# EAGLE design VBTSwakeupRadio (EAGLE 5.08)
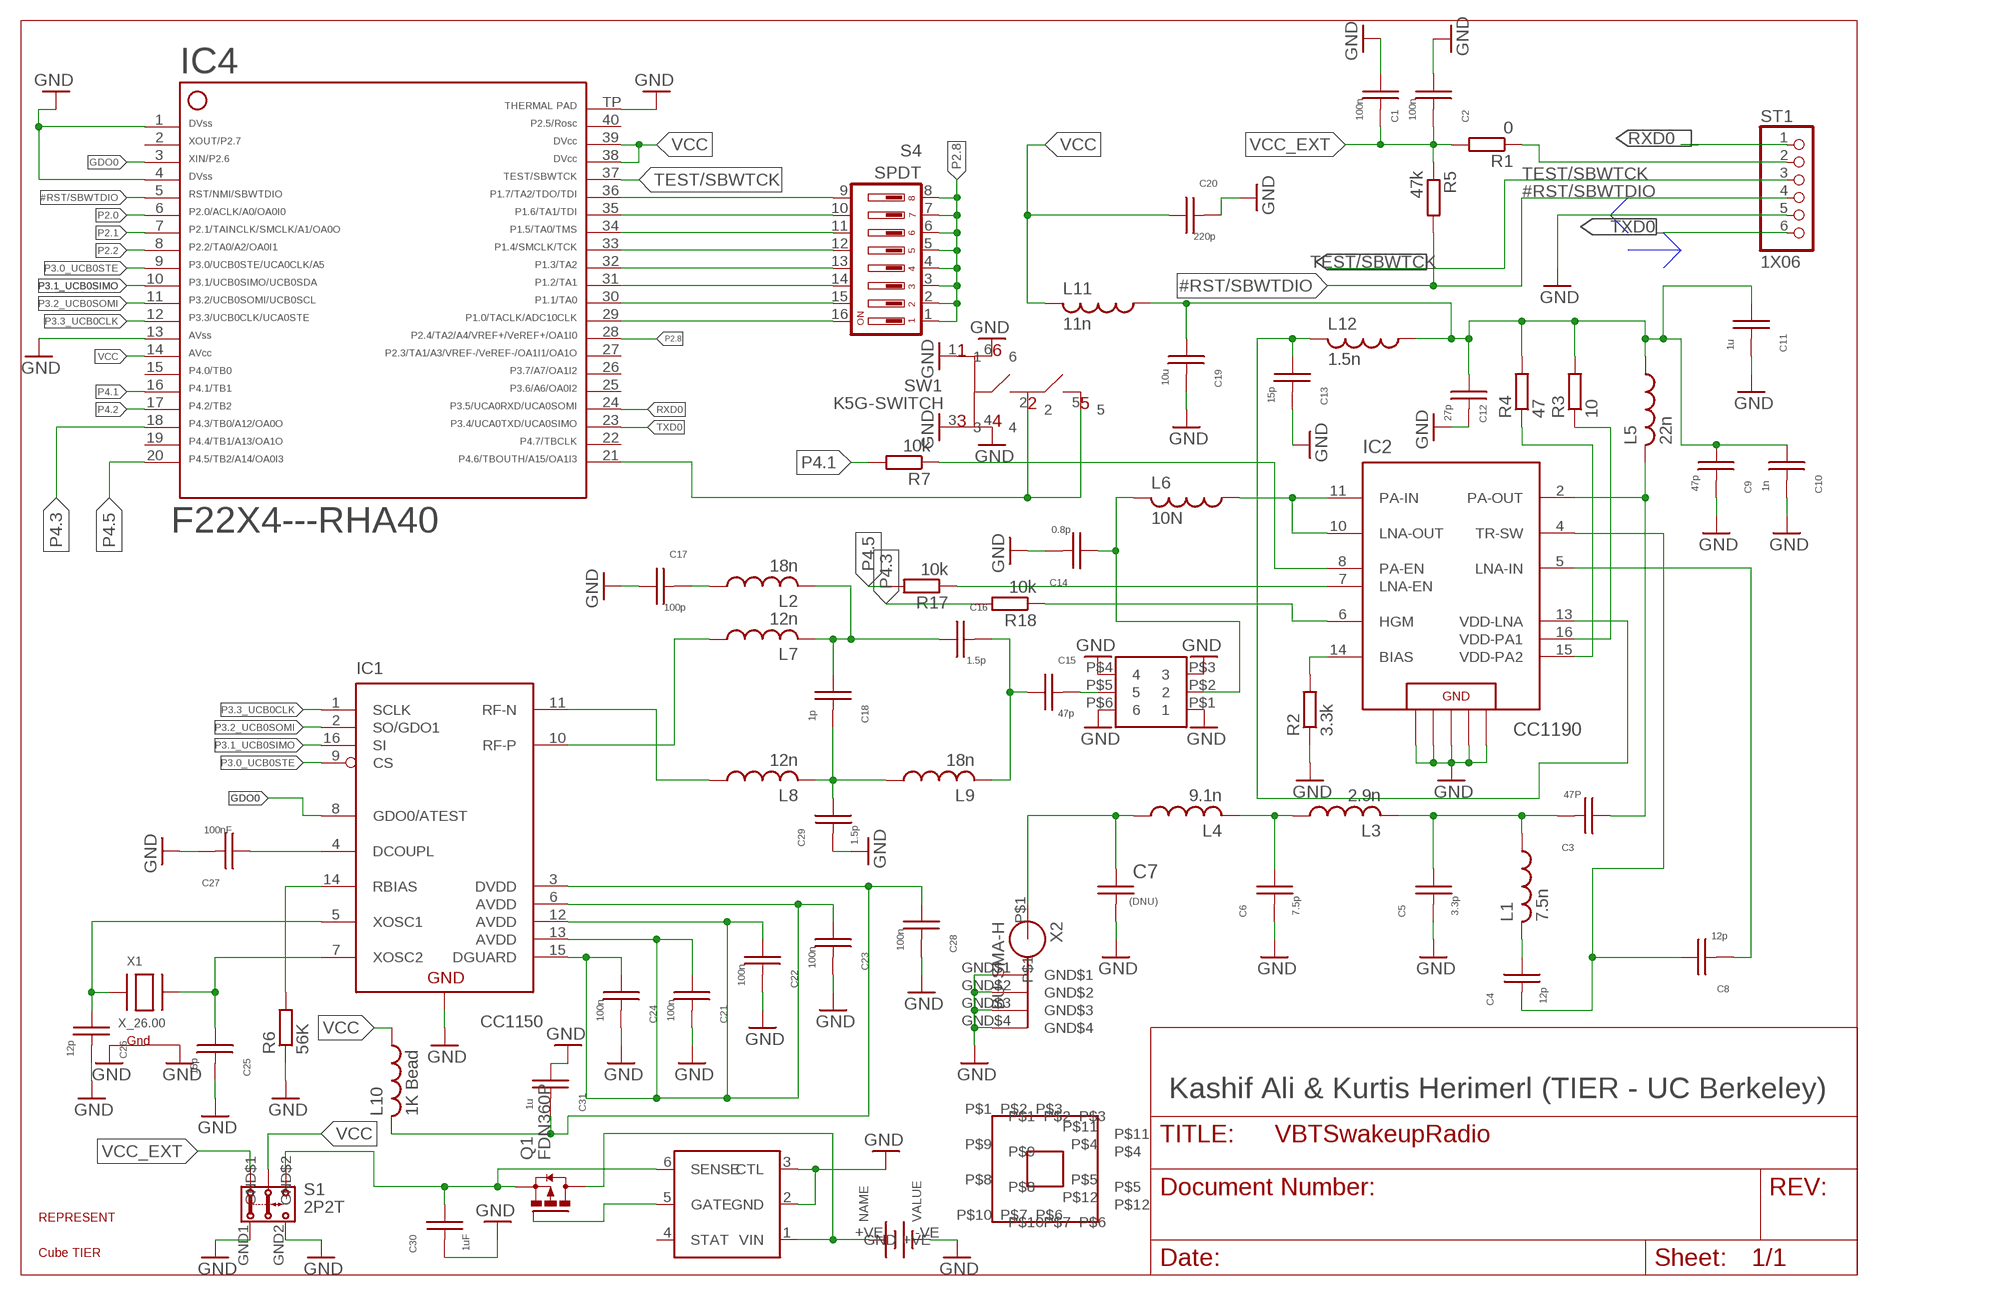
[diagram p0: schematic, sheet 1]

## Parts
C1  100n  C-USC0402  [C0402]
C2  100n  C-USC0402  [C0402]
C3  47P  C-USC0402  [C0402]
C4  12p  C-USC0402  [C0402]
C5  3.3p  C-USC0402  [C0402]
C6  7.5p  C-USC0402  [C0402]
C7  (DNU)  C-USC0402  [C0402]
C8  12p  C-USC0402  [C0402]
C9  47p  C-USC0402  [C0402]
C10  1n  C-USC0402  [C0402]
C11  1u  C-USC0402  [C0402]
C12  27p  C-USC0402  [C0402]
C13  15p  C-USC0402  [C0402]
C14  0.8p  C-USC0402  [C0402]
C15  47p  C-USC0402  [C0402]
C16  1.5p  C-USC0402  [C0402]
C17  100p  C-USC0402  [C0402]
C18  1p  C-USC0402  [C0402]
C19  10u  C-USC0402  [C0402]
C20  220p  C-USC0402  [C0402]
C21  100n  C-USC0402  [C0402]
C22  100n  C-USC0402  [C0402]
C23  100n  C-USC0402  [C0402]
C24  100n  C-USC0402  [C0402]
C25  15p  C-USC0402  [C0402]
C26  12p  C-USC0402  [C0402]
C27  100nF  C-USC0402  [C0402]
C28  100n  C-USC0402  [C0402]
C29  1.5p  C-USC0402  [C0402]
C30  1uF  C-USC0805  [C0805]
C31  1u  C-USC0402  [C0402]
IC1  CC1150  [QFN65P400X400X95-17N]
IC2  CC1190  [QFN65P400X400X100-17N]
IC3  B3588  [B3588]
IC4  F22X4---RHA40  [RHA40]
L1  7.5n  L-USL2012C  [L2012C]
L2  18n  L-USL2012C  [L2012C]
L3  2.9n  L-USL2012C  [L2012C]
L4  9.1n  L-USL2012C  [L2012C]
L5  22n  L-USL2012C  [L2012C]
L6  10N  L-USL2012C  [L2012C]
L7  12n  L-USL2012C  [L2012C]
L8  12n  L-USL2012C  [L2012C]
L9  18n  L-USL2012C  [L2012C]
L10  1K Bead  L-USL2012C  [L2012C]
L11  11n  L-USL2012C  [L2012C]
L12  1.5n  L-USL2012C  [L2012C]
Q1  FDN360P  [SUPER-SOT3]
R1  0  R-EU_R0402_GE  [C0402_GE]
R2  3.3k  R-EU_R0402  [R0402]
R3  10  R-EU_R0402  [R0402]
R4  47  R-EU_R0402  [R0402]
R5  47k  R-EU_R0402_GE  [C0402_GE]
R6  56K  R-EU_R0402  [R0402]
R7  10k  R-EU_R0402  [R0402]
R17  10k  R-EU_R0402  [R0402]
R18  10k  R-EU_R0402  [R0402]
S1  2P2T  [2P2T]
S3  BMI-S-202  [BMI-S-202-F]
S4  SPDT  DIP08YL  [DIP08YL]
ST1  1X06  [1X06]
SW1  K5G-SWITCH  [K5G-SWITCH]
U1  LTC4412  [LTC4412]
U$1  BATTERY-HOLDER  [BATTER-HOLDER]
U$2  CUBETIERABV  [SMALLABV]
U$3  REPRESENT-50  [REPRESENT-50]
X1  X_26.00  XTAL-4-3225  [NX3225]
X2  BU-SMA-H  [BU-SMA-H]

## Nets
#RST/SBWTDIO: IC4.5 R5.P$2 ST1.4
GDO0: IC1.8(GDO0/ATEST) IC4.3
GND [Ground]: C1.1 C2.1 C5.2 C6.2 C7.2 C9.2 C10.2 C11.2 C12.2 C13.2 C14.2 C17.1 C19.2 C20.2 C21.2 C22.2 C23.2 C24.2 C25.2 C26.2 C27.2 C28.2 C29.2 C30.2 C31.1 IC1.17(GND) IC2.1(GND) IC2.3(GND) IC2.9(GND) IC2.12(GND) IC2.17(GND-PL) IC3.P$1 IC3.P$3 IC3.P$4 IC3.P$6 IC4.1 IC4.4 IC4.13 IC4.TP R2.1 R6.1 S1.GND1(GND$1) S1.GND2(GND$2) ST1.5 SW1.1 SW1.3 SW1.4 SW1.6 U1.2(GND) U1.3(CTL) U$1.-VE(GND) X1.2(G2) X1.4(G1) X2.GND$1 X2.GND$2 X2.GND$3 X2.GND$4
N$1: IC2.8(PA-EN) R7.1
N$2: C3.2 C5.1 L1.1 L3.2
N$3: C6.1 L3.1 L4.2
N$4: C4.1 L1.2
N$5: C7.1 L4.1 X2.P$1
N$6: C8.2 IC2.5(LNA-IN)
N$7: C14.1 IC3.P$2 L6.2
N$8: C15.2 IC3.P$5
N$9: IC2.14(BIAS) R2.2
N$10: IC2.16(VDD-PA1) R3.1
N$11: IC2.15(VDD-PA2) R4.1
N$12: C13.1 IC2.13(VDD-LNA) L12.2
N$13: IC2.10(LNA-OUT) IC2.11(PA-IN) L6.1
N$14: C15.1 C16.2 L9.2
N$15: C18.2 C29.1 L8.2 L9.1
N$16: C16.1 C18.1 L2.2 L7.2
N$17: IC1.11(RF-N) L8.1
N$18: IC1.10(RF-P) L7.1
N$19: IC2.6(HGM) R18.1
N$20: C28.1 C31.2 IC1.3(DVDD) L10.2
N$21: C17.2 L2.1
N$22: IC4.31 S4.14
N$23: IC4.21 SW1.2 SW1.5
N$24: IC1.14(RBIAS) R6.2
N$27: C3.1 IC2.2(PA-OUT) L5.2
N$28: C26.1 IC1.5(XOSC1) X1.1(X1)
N$29: C25.1 IC1.7(XOSC2) X1.3(X2)
N$30: C27.1 IC1.4(DCOUPL)
N$34: IC2.7(LNA-EN) R17.1
N$35: C4.2 C8.1 IC2.4(TR-SW)
N$36: Q1.1(G) U1.5(GATE)
N$37: IC4.32 S4.13
N$38: IC4.29 S4.16
N$39: Q1.3(D) U1.1(VIN) U$1.+VE
N$40: C30.1 Q1.2(S) S1.3.1 U1.6(SENSE)
N$41: C9.1 C10.1 C11.1 C12.1 C19.1 L5.1 L11.1 L12.1 R3.2 R4.2
N$42: IC4.33 S4.12
N$43: IC4.34 S4.11
N$44: IC4.35 S4.10
N$45: IC4.36 S4.9
P2.0: IC4.6
P2.1: IC4.7
P2.2: IC4.8
P2.8: IC4.28 S4.1 S4.2 S4.3 S4.4 S4.5 S4.6 S4.7 S4.8
P3.0_UCB0STE: IC1.9(CS) IC4.9
P3.1_UCB0SIMO: IC1.16(SI) IC4.10
P3.2_UCB0SOMI: IC1.2(SO/GDO1) IC4.11
P3.3_UCB0CLK: IC1.1(SCLK) IC4.12
P4.1: IC4.16 R7.2
P4.2: IC4.17
P4.3: IC4.18 R18.2
P4.4: IC4.30 S4.15
P4.5: IC4.20 R17.2
RXD0: IC4.24 ST1.1
TEST/SBWTCK: IC4.37 ST1.3
TXD0: IC4.23 ST1.6
V: R1.P$1 ST1.2
VCC: C20.1 C21.1 C22.1 C23.1 C24.1 IC1.6(AVDD) IC1.12(AVDD) IC1.13(AVDD) IC1.15(DGUARD) IC4.14 IC4.38 IC4.39 L10.1 L11.2 S1.2.1
VCC_EXT: C1.2 C2.2 R1.P$2 R5.P$1 S1.1.1
Unconnected: IC4.2 IC4.15 IC4.19 IC4.22 IC4.25 IC4.26 IC4.27 IC4.40 S3.P$1 S3.P$2 S3.P$3 S3.P$4 S3.P$5 S3.P$6 S3.P$7 S3.P$8 S3.P$9 S3.P$10 S3.P$11 S3.P$12 U1.4(STAT)

## Notes on the sheet
- Kashif Ali & Kurtis Herimerl (TIER - UC Berkeley)

## Library data of the parts
C1-C31 = vbts:C-US: CAPACITOR, American symbol
IC1 = chipcon-ti-v2:CC1150: Single Chip Low Cost Low Power RF-Transmitter
IC2 = chipcon-ti-v2:CC1190: 850 - 950 MHz RF Front End
IC3 = vbts:B3588: SAW
IC4 = vbts:F22X4---RHA40: ***MSP430F22x4***RHA40
L1-L12 = vbts:L-US: INDUCTOR, American symbol
Q1 = transistor-power:FDN360P: Single P-Channel, PowerTrench (R) MOSFET Source: http://www.fairchildsemi.com/ds/FD/FDN360P.pdf
R1 R5 = rcl:R-EU_: RESISTOR, European symbol
R2-R4 R6 R7 R17 R18 = vbts:R-EU_: RESISTOR, European symbol
S1 = vbts:2P2T: SLIDE SWITCH SPDT Part No. JS102000SAQN Source: http://search.digikey.com/scripts/DkSearch/dksus.dll?Detail&itemSeq=112587719&uq=634684747549229980
S3 = vbts:BMI-S-202
S4 = vbts:DIP08YL: DIL/CODE SWITCH I-1825058-9 http://search.digikey.com/scripts/DkSearch/dksus.dll?Detail&itemSeq=112401346&uq=634685631903277898
ST1 = pinhead_1.27mm:1X06
SW1 = vbts:K5G-SWITCH
U1 = vbts:LTC4412
U$1 = vbts:BATTERY-HOLDER
U$2 = TIERLogo-1:CUBETIERABV
U$3 = TIERLogo-1:REPRESENT-50
X1 = vbts:XTAL-4: CRYSTAL 26.000 MHZ 10PF SMD http://search.digikey.com/scripts/DkSearch/dksus.dll?Detail&itemSeq=112341585&uq=634679703811047285
X2 = vbts:BU-SMA-H: FEMALE SMA CONNECTOR Radiall

## Net classes
0 default: width 0.1 mm, drill 0.2 mm
1 Ground: width 0.1 mm, drill 0.2 mm

## Board
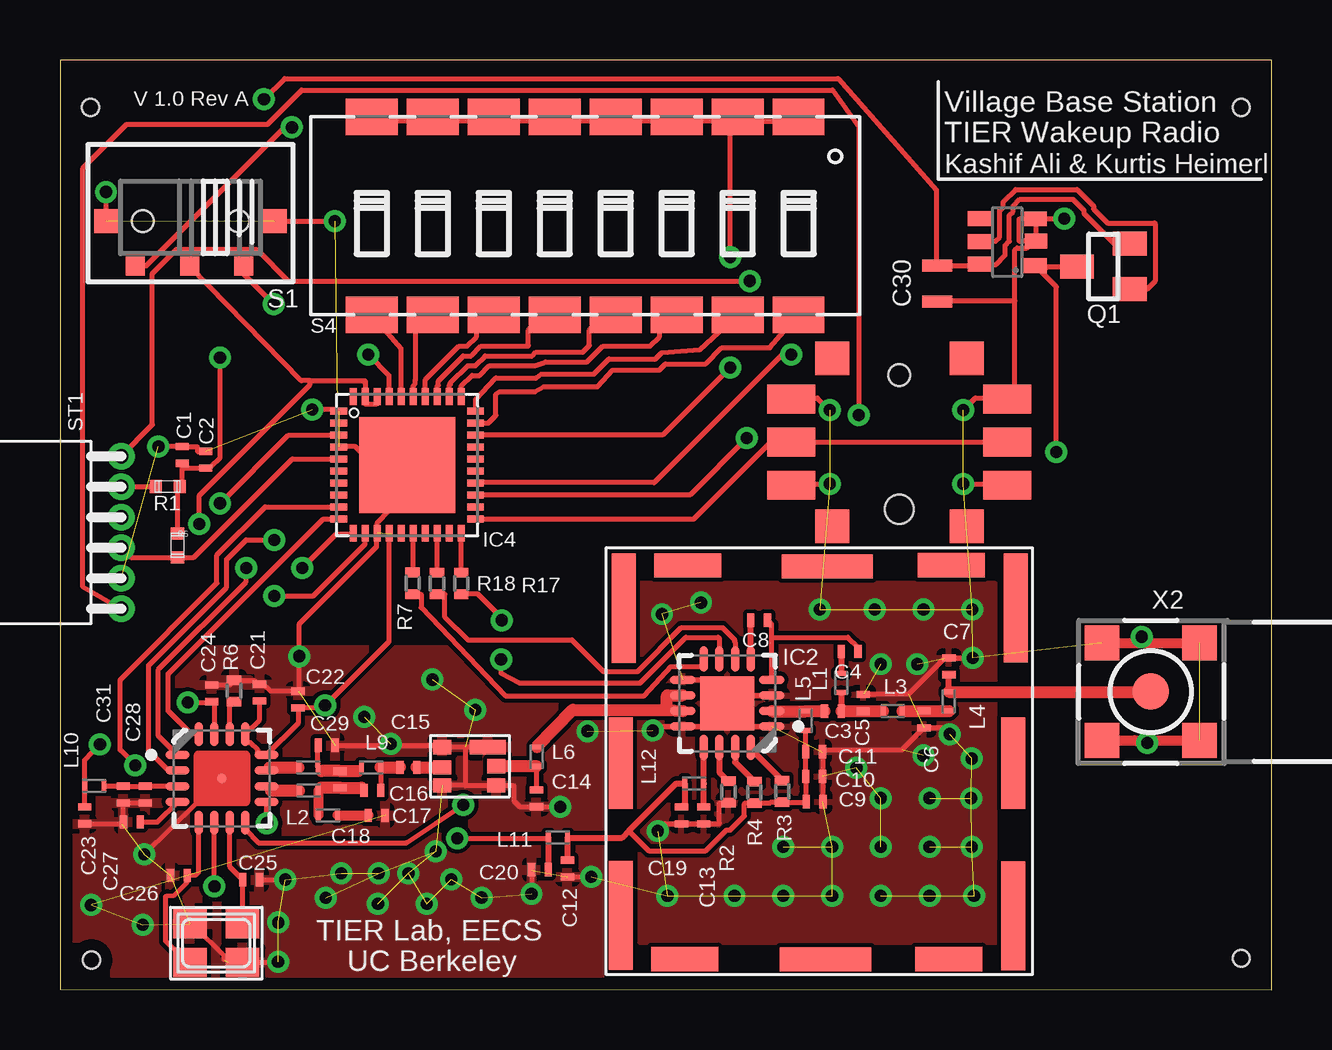
[diagram p1: board, top side]
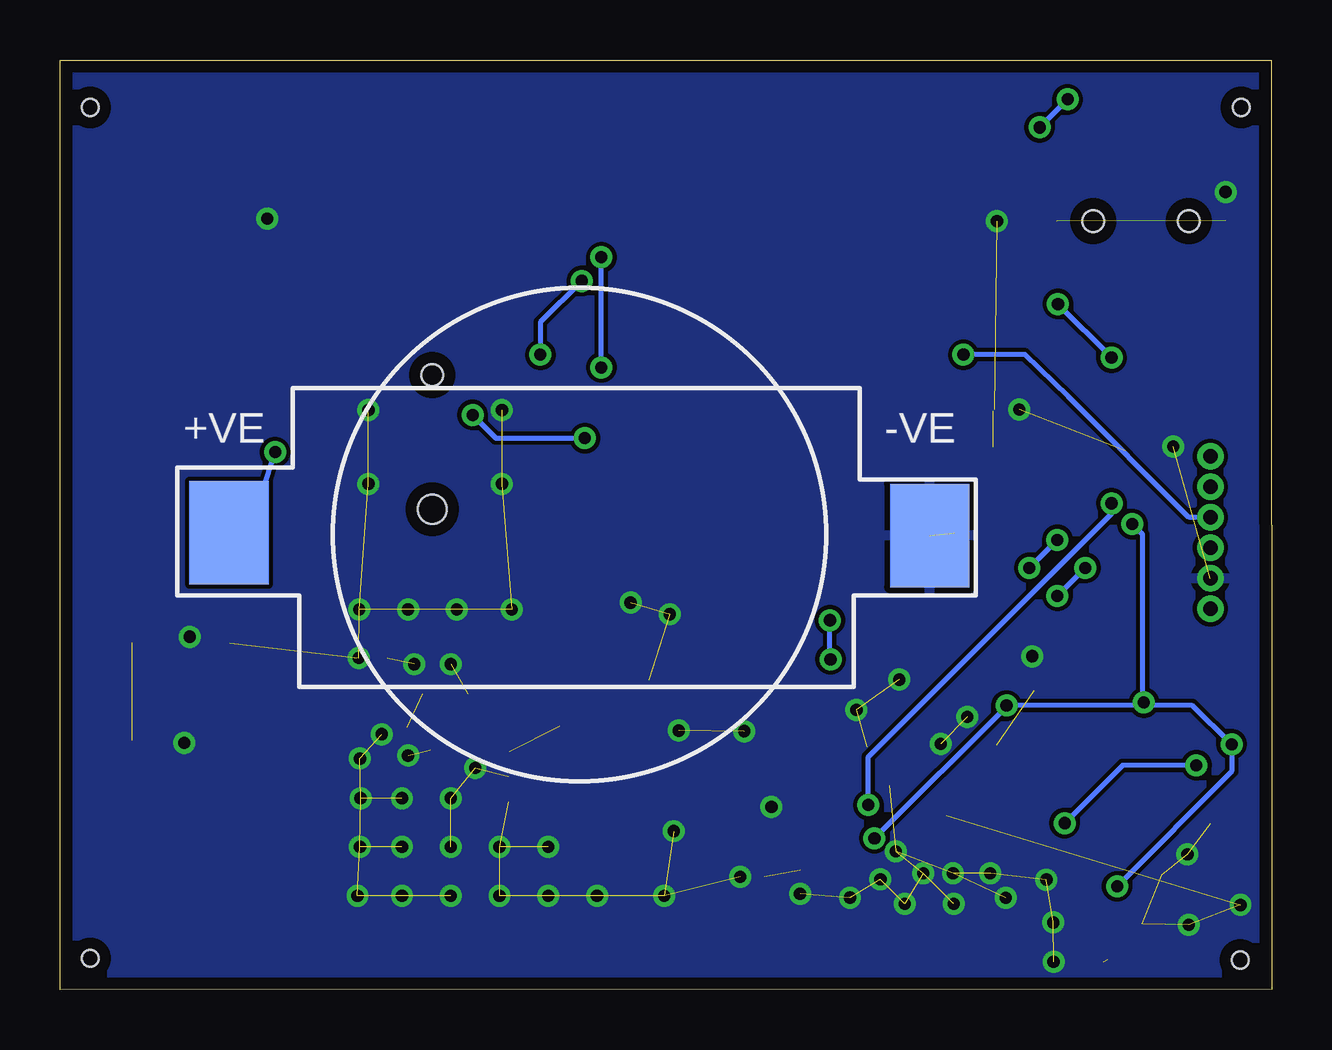
[diagram p2: board, bottom side, seen from below]

Size 50.48 x 38.75 mm. Coordinates in mm from the lower left corner, seen from the top.
Outline: 0,0.01 50.48,0 50.48,38.75 0.01,38.75 0,0.01
Copper layers (1*16): Top 0.0356mm / dielectric 1.5011mm / Bottom 0.0356mm
Design rules "SilverCircuits": minimum track width 7mil, minimum drill 14mil, track to track 7mil, track to pad 7mil, pad to pad 7mil, via to via 7mil, smd to smd 0mil, copper to edge 20mil, drill to drill 8mil, minimum pad ring 10mil, minimum via ring 8mil, stop-mask expansion 4mil, vias tented up to drill 0mil, thermal gap 10mil
Holes 0.7 mm at 1.31,1.23 49.22,1.3 49.22,36.77 1.27,36.77

### Footprints (pad centres in the part's own frame; a part is rotated, then mirrored left to right if it is on the bottom)
C0402 = smd 0.3 x 0.55: 1 -0.35,0; 2 0.35,0
C0805 = smd 0.5 x 1.25: 1 -0.75,0; 2 0.75,0
QFN65P400X400X95-17N = smd 1 x 0.35: 1 -1.85,0.975; 2 -1.85,0.325; 3 -1.85,-0.325; 4 -1.85,-0.975; 9 1.85,-0.975; 10 1.85,-0.325; 11 1.85,0.325; 12 1.85,0.975 | smd 0.35 x 1: 5 -0.975,-1.85; 6 -0.325,-1.85; 7 0.325,-1.85; 8 0.975,-1.85; 13 0.975,1.85; 14 0.325,1.85; 15 -0.325,1.85; 16 -0.975,1.85 | smd 0.4 x 0.4: 17 0,0
QFN65P400X400X100-17N = smd 1.05 x 0.35: 1 -1.85,0.975; 2 -1.85,0.325; 3 -1.85,-0.325; 4 -1.85,-0.975; 9 1.85,-0.975; 10 1.85,-0.325; 11 1.85,0.325; 12 1.85,0.975 | smd 0.35 x 1.05: 5 -0.975,-1.85; 6 -0.325,-1.85; 7 0.325,-1.85; 8 0.975,-1.85; 13 0.975,1.85; 14 0.325,1.85; 15 -0.325,1.85; 16 -0.975,1.85 | smd 2.25 x 2.25: 17 0,0
B3588 = smd 0.6 x 1.5: P$1 -0.8,0.75 | smd 0.6 x 0.75: P$2 0,1.1; P$3 0.8,1.1; P$4 0.8,-1.15; P$5 0.05,-1.15; P$6 -0.8,-1.15
RHA40 = smd 0.7 x 0.3: 1 -2.85,2.25; 2 -2.85,1.75; 3 -2.85,1.25; 4 -2.85,0.75; 5 -2.85,0.25; 6 -2.85,-0.25; 7 -2.85,-0.75; 8 -2.85,-1.25; 9 -2.85,-1.75; 10 -2.85,-2.25; 21 2.85,-2.25; 22 2.85,-1.75; 23 2.85,-1.25; 24 2.85,-0.75; 25 2.85,-0.25; 26 2.85,0.25; 27 2.85,0.75; 28 2.85,1.25; 29 2.85,1.75; 30 2.85,2.25 | smd 0.3 x 0.7: 11 -2.25,-2.85; 12 -1.75,-2.85; 13 -1.25,-2.85; 14 -0.75,-2.85; 15 -0.25,-2.85; 16 0.25,-2.85; 17 0.75,-2.85; 18 1.25,-2.85; 19 1.75,-2.85; 20 2.25,-2.85; 31 2.25,2.85; 32 1.75,2.85; 33 1.25,2.85; 34 0.75,2.85; 35 0.25,2.85; 36 -0.25,2.85; 37 -0.75,2.85; 38 -1.25,2.85; 39 -1.75,2.85; 40 -2.25,2.85 | smd 4 x 4: TP 0,0
L2012C = smd 0.2 x 0.5: 1 -0.4,0; 2 0.4,0
SUPER-SOT3 = smd 1 x 1.4: 1 -0.95,-1.1; 2 0.95,-1.1; 3 0,1.1
C0402_GE = smd 0.5 x 0.55: P$1 -0.5,0; P$2 0.5,0
R0402 = smd 0.4 x 0.6: 1 -0.45,0; 2 0.45,0
2P2T = smd 0.787 x 0.787: 1.1 -2.845,2.794; 2.1 -0.584,2.794; 3.1 1.676,2.794 | smd 0.991 x 0.991: GND1 -4.14,0.914; GND2 2.896,0.914 | hole 0.9: 1.372,0.914; -2.616,0.914
BMI-S-202-F = smd 2.794 x 1.016: P$1 3.164,0; P$8 3.279,16.405; P$9 14.271,16.425; P$10 14.161,0 | smd 3.8 x 1: P$2 9.025,0; P$6 9.1,16.37 | smd 1 x 4.55: P$3 0.5,1.825; P$5 0.61,14.63; P$7 16.95,14.64; P$11 16.85,1.8 | smd 1 x 3.8: P$4 0.5,8.17; P$12 16.85,8.17
DIP08YL = smd 2.159 x 1.524: 1 -8.89,-4.445; 2 -6.35,-4.445; 3 -3.81,-4.445; 4 -1.27,-4.445; 5 1.27,-4.445; 6 3.81,-4.445; 7 6.35,-4.445; 8 8.89,-4.445; 9 8.89,3.81; 10 6.35,3.81; 11 3.81,3.81; 12 1.27,3.81; 13 -1.27,3.81; 14 -3.81,3.81; 15 -6.35,3.81; 16 -8.89,3.81
1X06 = drill 0.6 round: 1 -3.175,0; 2 -1.905,0; 3 -0.635,0; 4 0.635,0; 5 1.905,0; 6 3.175,0
K5G-SWITCH = smd 1.2 x 2: 1 -2.55,1.65; 2 -0.75,1.65; 3 1.05,1.65; 4 1.05,-7.35; 5 -0.75,-7.35; 6 -2.55,-7.35 | smd 1.4 x 1.42: P$7 -4.25,-0.05; P$8 2.75,-0.05; P$9 -4.25,-5.65; P$10 2.75,-5.65 | hole 0.9: 2.05,-2.85 | hole 1.2: -3.55,-2.85
LTC4412 = smd 0.62 x 0.95: 1 -1.01,-0.94; 2 0.01,-0.97; 3 0.94,-0.95; 4 0.95,1.4; 5 0,1.4; 6 -0.95,1.4
BATTER-HOLDER = smd 3.302 x 4.318: +VE -14.6,0.073; -VE 14.6,-0.046
NX3225 = smd 1.4 x 1.2: 1 -1.1,-0.8; 2 1.1,-0.8; 3 1.1,0.8; 4 -1.1,0.8
BU-SMA-H = smd 1.448 x 1.448: GND$1 2.032,2.032; GND$2 -2.032,2.032; GND$3 -2.032,-2.032; GND$4 2.032,-2.032 | smd 1.524 x 1.524: P$1 0,0

### Placement (x,y rotation side)
C1  5.09,22.29 270 top
C2  6.07,22.09 270 top
C3  32.2,11.61 0 top
C4  32.9,14.09 0 top
C5  33.46,11.96 90 top
C6  36,11.26 270 top
C7  37.04,13.48 90 top
C8  29.13,15.39 180 top
C9  31.44,7.83 0 top
C10  31.42,8.89 0 top
C11  31.42,9.91 0 top
C12  21.15,5.05 270 top
C13  26.83,7.26 270 top
C14  19.85,7.98 270 top
C15  14.51,9.26 0 top
C16  13.01,8.3 0 top
C17  13.2,7.26 180 top
C18  11.67,8.76 90 top
C19  25.9,7.26 270 top
C20  20,5 180 top
C21  8.32,12.38 90 top
C22  9.92,12.09 90 top
C23  1.03,7.27 270 top
C24  6.32,12.35 90 top
C25  7.96,4.58 0 top
C26  4.95,4.76 180 top
C27  2.99,7 180 top
C28  3.55,8.13 270 top
C29  11.11,10.19 0 top
C30  36.56,29.44 270 top
C31  2.64,8.13 90 top
IC1  6.75,8.8 0 top
IC2  27.8,11.94 180 top
IC3  17.08,9.31 270 top
IC4  14.47,21.87 0 top
L1  32.55,12.78 90 top
L2  11.16,7.26 180 top
L3  34.7,11.61 180 top
L4  37.04,12.01 270 top
L5  31.07,11.2 90 top
L6  19.87,9.71 270 top
L7  10.36,8.3 0 top
L8  10.35,9.26 0 top
L9  12.96,9.26 0 top
L10  1.43,8.48 0 top
L11  20.74,6.33 180 top
L12  26.43,8.59 0 top
Q1  43.47,30.14 90 top
R1  4.49,20.97 0 top
R2  27.85,8.23 90 top
R3  30.09,8.26 270 top
R4  28.93,8.22 270 top
R5  4.9,18.52 270 top
R6  7.25,12.45 270 top
R7  14.69,16.94 90 top
R17  16.72,16.93 90 top
R18  15.71,16.93 90 top
S1  4.82,32.95 180 top
S3  22.87,1.27 0 top
S4  21.88,31.94 180 top
ST1  2.55,19.05 270 top
SW1  32.12,23.57 90 top
U1  39.7,31.18 90 top
U$1  28.84,18.97 0 bottom
U$2  46.74,22.97 270 top
U$3  43.88,6.23 270 top
X1  6.51,1.94 0 top
X2  45.45,12.42 0 top

### Tracks (layer width: path | path; a pad name or v marks a point on that pad's centre or on a via)
#RST/SBWTDIO
  Top 0.203: ST1.4 | IC4.5 9.69,22.12 5.58,18.02 R5.P$2 2.95,18.02 ST1.4
  Bottom 0.203: ST1.4 2.51,18.41 2.51,18.43
GDO0  (via drill 0.51)
  Top 0.203: v6.67,20.27 9.51,23.11 11.59,23.11 IC4.3 | v16.8,7.7 14.44,6.12 8.27,6.12 7.73,6.66 7.73,6.93 IC1.8
  Bottom 0.203: v6.67,20.27 6.67,19.84 16.8,9.7 v16.8,7.7
GND  (via drill 0.51)  (68 unrouted)
  Top 0.178: v3.51,5.63 IC1.17 | X1.4 5.6,2.64 6.82,1.42 6.82,1.23
  Top 0.203: v38.04,13.82 37.05,13.82 C7.2 36.94,13.79 36.84,13.79 35.37,12.32 33.49,12.32 C5.2 | IC2.17 27.11,11.94 27.09,11.91 27.09,11.35 26.71,10.97 25.97,10.97 IC2.12 25.87,10.97 24.88,10.97 v24.7,10.79 | IC2.9 25.97,12.9 26.71,12.9 27.06,12.55 27.06,12.01 IC2.17 | IC2.1 29.63,10.97 28.89,10.97 28.54,11.33 28.54,11.91 28.51,11.94 27.9,11.94 IC2.17 | IC2.3 29.63,12.27 28.87,12.27 28.59,11.99 IC2.17 | 16.88,8.51 IC3.P$4 | 16.88,8.51 18.1,8.51 IC3.P$3 18.2,8.51 18.88,8.51 18.91,8.48 18.91,7.87 19.16,7.62 C14.2 19.95,7.62 v20.84,7.62 | 16.88,10.11 IC3.P$6 15.86,10.19 13.78,10.19 | 16.88,10.11 17.82,10.11 IC3.P$1 | R2.1 27.47,7.77 27.47,6.93 27.44,6.91 26.91,6.91 C13.2 26.81,6.91 C19.2 25.82,6.91 25.21,6.91 v24.9,6.6 | v19.65,3.99 19.65,4.98 C20.2 | C12.2 v22.14,4.7 | C12.2 | v37.07,10.64 36.84,10.92 36,10.92 C6.2 35.93,10.85 35.06,9.98 31.86,9.98 C11.2 31.79,9.91 31.79,8.89 C10.2 31.79,8.81 31.79,7.85 C9.2 | 11.59,22.63 IC4.4 11.7,22.63 12.31,22.63 13.04,21.89 13.65,21.89 IC4.TP 13.75,21.87 13.73,21.84 13.73,19.96 13.22,19.46 IC4.13 13.2,18.92 13.2,18.47 9.97,15.24 v9.97,13.89 9.97,12.52 C22.2 9.89,12.45 8.78,12.45 8.5,12.72 C21.2 8.22,12.75 8.09,12.88 7.35,12.88 R6.1 7.25,12.88 7.07,12.7 6.34,12.7 C24.2 | 11.59,24.13 IC4.1 11.55,24.18 v10.52,24.18 | v32.07,21.08 30.37,21.08 SW1.1 | v32.07,24.16 31.56,24.66 30.37,24.66 SW1.3 | v37.63,21.08 39.33,21.08 SW1.6 | v37.63,24.16 38.14,24.66 39.33,24.66 SW1.4 39.43,24.66 39.79,24.66 39.79,28.7 | U1.2 40.65,31.22 40.65,32.11 U1.3 | C2.1 6.06,22.43 5.73,22.43 5.73,22.61 5.7,22.63 C1.1 5.02,22.63 v4.1,22.63 | v41.85,32.13 40.73,32.13 U1.3
  Top 0.203: 39.79,28.7 39.79,30.84 39.87,30.91 40.27,30.91 40.53,31.17 40.53,31.19 39.99,31.19 39.97,31.22 39.97,32.11 39.99,32.13 40.55,32.13 U1.3 | v1.92,33.25 1.92,32.05 S1.GND2 | v11.44,32.03 8.98,32.03 S1.GND1 | C30.2 36.56,28.7 39.79,28.7 | C28.2 C31.1 C27.2 2.57,6.92 C23.2 | C25.2 v9.38,4.58 | v9.09,1.16 9.07,1.14 X1.2 7.01,1.14 | 16.88,10.11 16.88,8.51 | 13.78,10.19 C29.2 | 13.78,10.19 v13.78,10.24
  Top 0.406: X2.GND$3 44.77,10.39 | 44.77,10.39 X2.GND$4 | 44.77,10.39 v45.3,10.29 | 44.84,14.45 X2.GND$1 | X2.GND$2 44.84,14.45 | 44.84,14.45 v45.07,14.71
  other vias: 11.07,3.82 21.98,10.77 17.3,11.65 15.66,5.76 12.68,11.36 9.1,2.79 3.45,2.7 37.99,9.63 37.96,7.98 33.19,9.25 38.09,3.91 37.99,5.94 35.73,13.56 34.2,13.56 38.01,15.85 35.98,9.75 36.23,7.98 36.23,5.94 36.23,3.91 34.2,7.98 34.2,5.94 34.2,3.91 32.17,3.91 32.17,5.94 30.14,5.94 30.14,3.91 28.11,3.91 35.98,15.85 33.95,15.85 31.66,15.85 25.31,3.91 13.27,4.85 14.52,4.85 11.72,4.85 15.28,3.58 13.25,3.58 15.52,12.92 1.3,3.52 16.3,4.59 17.57,3.83 25.08,15.65 26.71,16.13
  pour Bottom: 0.01,37.85 -0.2,-0.43 50.56,0 50.56,38.58 0.27,38.58 0.27,37.59
  pour Top: 24.16,1.96 38.98,1.96 38.98,16.93 24.12,16.93
  pour Top: 0.75,14.15 22.39,14.15 22.39,12.95 22.47,12.95 22.47,0.51 0.7,0.51 0.7,14.1 0.9,14.1
N$1
  Top 0.203: R7.1 15.02,16.48 15.05,16.46 15.05,15.93 18.55,12.24 24.35,12.24 25.46,13.46 26.83,13.46 26.83,13.77 IC2.8
N$2
  Top 0.254: C5.1 | C3.2 L1.1 | L3.2
  Top 0.508: C3.2 C5.1 | C5.1 L3.2
N$3
  Top 0.254: C6.1 | L4.2
  Top 0.508: L3.1 C6.1 | C6.1 L4.2
N$4
  Top 0.254: L1.2 C4.1
N$5
  Top 0.254: L4.1 C7.1
  Top 0.406: X2.P$1
  Top 0.508: L4.1 X2.P$1
N$6
  Top 0.254: IC2.5 C8.2
N$7
  Top 0.203: L6.2 19.86,8.34 C14.1
  Top 0.508: L6.2 IC3.P$2
N$8
  Top 0.203: IC3.P$5
  Top 0.508: C15.2 IC3.P$5
N$9
  Top 0.254: IC2.14 27.48,9.06 R2.2
N$10
  Top 0.254: IC2.16 28.78,10.02 R3.1
N$11
  Top 0.254: IC2.15 28.13,9.47 R4.1
N$12
  Top 0.254: IC2.13 L12.2 C13.1
N$13
  Top 0.203: 25.29,12.24 25.31,12.27 | IC2.10
  Top 0.508: L6.1 21.37,11.66 25.29,11.66 | 25.29,11.66 IC2.11 | 25.31,12.27 IC2.10 | 25.29,11.66 25.29,12.24
N$14
  Top 0.203: L9.2 C16.2
  Top 0.508: L9.2 C15.1
N$15
  Top 0.203: 10.9,9.11 L8.2 10.75,10.17 C29.1 | 12.41,9.11 L9.1
  Top 0.508: 10.9,9.11 C18.2 12.41,9.11
N$16
  Top 0.203: 10.88,8.41 L7.2 | 12.56,8.41 C16.1
  Top 0.406: L7.2 L2.2
  Top 0.508: 10.88,8.41 C18.1 12.56,8.41
N$17
  Top 0.203: IC1.11 8.73,9.26
  Top 0.508: 8.73,9.26 L8.1
N$18
  Top 0.203: IC1.10 8.78,8.3
  Top 0.508: 8.78,8.3 L7.1
N$19
  Top 0.203: R18.1 16.04,16.48 16.04,15.52 16.98,14.58 21.32,14.58 22.64,13.26 24.07,13.26 25.9,15.09 27.6,15.09 28.1,14.58 28.1,14.5 28.13,14.48 IC2.6
N$20
  Top 0.203: IC1.3 C28.1 C31.2 L10.2
N$21
  Top 0.406: L2.1 C17.2
N$22
  Top 0.203: IC4.31 16.73,24.74 16.73,25.17 17.16,25.6 17.49,25.6 17.89,26.01 19.8,26.01 20.23,26.16 21.96,26.16 22.62,26.82 24.57,26.82 24.98,27.23 24.98,27.91 25.01,27.94 25.69,27.94 S4.14
N$23
  Top 0.203: SW1.5 SW1.2 30.26,22.86 29.65,22.86 26.4,19.61 17.34,19.61 IC4.21
N$24
  Top 0.203: IC1.14 7.07,11.82 R6.2
N$27
  Top 0.203: IC2.2 29.66,11.6 | L5.2
  Top 0.254: C3.1
  Top 0.508: 29.66,11.6 L5.2 | L5.2 C3.1
N$28
  Top 0.178: 4.46,3.89 4.48,3.91 4.74,3.91 5.3,4.47 C26.1 5.66,4.76 5.77,4.88
  Top 0.203: 5.77,4.88 IC1.5 | 4.46,3.89 4.4,3.88 4.4,2.02 5.03,1.41 X1.1
N$29
  Top 0.203: 7.45,2.64 X1.3 C25.1 7.07,5.12 IC1.7
N$30
  Top 0.203: C27.1 4.06,6.99 IC1.4
N$34  (via drill 0.51)
  Top 0.203: v18.38,13.77 18.38,13.18 19.14,12.78 24.17,12.78 26.07,14.68 27.42,14.68 27.47,14.63 27.47,13.79 IC2.7 | v18.4,15.39 18.4,15.49 17.41,16.48 R17.1
  Bottom 0.203: v18.38,13.77 18.4,13.79 v18.4,15.39
N$35
  Top 0.203: C8.1 29.65,15.22 29.65,14.68 | IC2.4 29.65,14.68 | C4.2 33.24,14.1 33.24,14.28 32.83,14.68 29.65,14.68
N$36
  Top 0.203: U1.5 38.32,31.19 38.98,31.19 39.15,31.37 39.15,32.46 39.31,32.61 39.31,32.84 39.81,33.35 42.38,33.35 43.07,32.66 43.07,32.54 43.65,31.95 45.61,31.95 45.63,31.93 45.63,29.54 45.28,29.18 44.59,29.18 Q1.1
N$37
  Top 0.203: S4.13 23.15,27.94 22.52,27.94 22.06,27.48 22.06,26.85 21.78,26.57 19.82,26.57 19.67,26.42 17.72,26.42 17.31,26.01 16.98,26.01 16.27,25.3 16.27,25.22 16.22,25.17 16.22,24.74 IC4.32
N$38
  Top 0.203: S4.16 29.58,26.76 27.58,26.76 26.9,26.08 25.23,26.08 24.97,25.81 23.03,25.81 22.4,25.13 20.15,25.13 19.79,24.93 18.32,24.93 18.16,24.82 18.16,23.93 17.85,23.62 IC4.29
N$39  (via drill 0.51)
  Top 0.203: U1.1 40.67,30.14 Q1.3 | U1.1 41.06,30.05 | v41.52,22.4 41.52,29.3 U1.1
  Bottom 0.203: v41.52,22.4 42.61,19.05 43.42,19.05 U$1.+VE
N$40  (via drill 0.51)
  Top 0.203: Q1.2 43.93,31.09 42.66,32.36 42.66,32.49 42.2,32.94 39.99,32.94 39.71,32.66 39.71,32.44 39.56,32.28 39.56,31.19 39.38,31.01 39.38,30.61 39,30.23 38.39,30.23 U1.6 38.25,30.19 C30.1 36.51,30.28 36.51,33.33 32.42,37.97 9.36,37.97 v8.5,37.11 | v9.66,35.94 9.36,35.94 3.59,30.18 3.16,30.18 S1.3.1
  Bottom 0.203: v9.66,35.94 v8.5,37.11
N$41
  Top 0.203: 23.7,6.61 23.79,6.53 24.52,5.79 26.91,5.79 27.77,6.66 27.93,6.66 28.51,7.24 28.51,7.75 28.54,7.77 28.84,7.77 R4.2 28.94,7.77 29.58,7.77 29.63,7.82 30.09,7.82 R3.2 31.07,7.81 C9.1 31.09,8.87 C10.1 C11.1 L5.1 | L5.1
  Top 0.254: C12.1 L11.1 23.43,6.33 23.7,6.61 25.68,8.59 L12.1 26.03,7.74 C19.1
N$42
  Top 0.203: S4.12 20.61,27.94 19.98,27.94 19.52,27.48 19.52,26.85 19.49,26.82 17.54,26.82 17.13,26.42 16.8,26.42 15.76,25.38 15.76,25.2 15.71,25.15 15.71,24.74 IC4.33
N$43
  Top 0.203: IC4.34 15.23,24.74 15.23,25.43 16.62,26.82 16.95,26.82 17.36,27.23 17.36,27.91 17.39,27.94 18.07,27.94 S4.11
N$44
  Top 0.203: IC4.35 14.72,24.74 14.72,25.17 14.8,25.25 14.8,25.4 14.82,25.43 14.82,27.91 14.85,27.94 15.53,27.94 S4.10
N$45
  Top 0.203: S4.9 14.22,26.73 IC4.36
P2.8  (via drill 0.51)
  Top 0.203: S4.8 13.02,36.2 15.53,36.2 S4.7 15.63,36.2 18.07,36.2 S4.6 18.17,36.2 20.61,36.2 S4.5 20.71,36.2 22.92,36.2 S4.4 23.18,36.2 25.69,36.2 S4.3 25.79,36.2 28.23,36.2 S4.2 | S4.1 30.77,36.2 28.33,36.2 S4.2 | v27.93,25.93 25.13,23.14 17.34,23.14 IC4.28 | v27.93,30.53 27.93,36.12 S4.2
  Bottom 0.203: v27.93,25.93 v27.93,30.53
P3.0_UCB0STE  (via drill 0.51)
  Top 0.203: v3.14,9.35 2.5,9.98 2.5,12.9 6.54,16.94 6.54,18.11 8.55,20.12 11.59,20.12 IC4.9 | v8.62,6.93 8.62,7.82 IC1.9
  Bottom 0.203: v3.14,9.35 6.21,9.35 v8.62,6.93
P3.1_UCB0SIMO
  Top 0.203: IC4.10 11.59,19.61 10.96,19.61 4.51,13.16 4.51,11.61 5.45,10.67 5.75,10.67 IC1.16
P3.2_UCB0SOMI  (via drill 0.51)
  Top 0.203: v10.1,17.58 11.52,19 12.2,19 IC4.11 | v8.93,18.75 7.76,18.75 6.95,17.93 6.95,16.76 3.7,13.51 3.7,9.96 4.51,9.14 4.89,9.14 IC1.2
  Bottom 0.203: v8.93,18.75 v10.1,17.58
P3.3_UCB0CLK  (via drill 0.51)
  Top 0.203: v8.93,16.41 10.55,16.41 12.71,18.57 12.71,19 IC4.12 | v7.76,17.58 7.76,16.99 4.1,13.34 4.1,10.57 4.89,9.78 IC1.1
  Bottom 0.203: v7.76,17.58 v8.93,16.41
P4.1
  Top 0.203: 14.67,17.4 R7.2 14.72,17.41 14.72,19 IC4.16
P4.3
  Top 0.203: R18.2 IC4.18
P4.4
  Top 0.203: S4.15 26.65,26.67 25.07,26.55 24.81,26.28 22.87,26.28 22.25,25.66 20.05,25.66 19.84,25.5 18.16,25.5 17.32,24.6 IC4.30
P4.5
  Top 0.203: R17.2 IC4.20
RXD0  (via drill 0.51)
  Top 0.203: v30.47,26.47 30.09,26.47 24.75,21.13 17.34,21.13 IC4.24 | v28.74,29.54 9.51,29.54 8.19,30.86 4.86,30.86 3.85,29.84 3.85,23.55 2.55,22.25 ST1.1
  Bottom 0.203: v30.47,26.47 30.47,27.81 v28.74,29.54
TEST/SBWTCK  (via drill 0.51)
  Top 0.203: v12.84,26.47 13.7,25.6 13.7,24.74 IC4.37
  Bottom 0.203: v12.84,26.47 10.28,26.47 8.47,24.71 3.44,19.68 ST1.3
TXD0  (via drill 0.51)
  Top 0.203: v28.61,22.99 26.25,20.62 17.34,20.62 IC4.23 | v33.29,23.95 33.29,35.97 32.19,37.49 10.07,37.49 8.65,36.07 2.78,36.07 0.95,34.24 0.95,16.79 2.53,15.88 ST1.6
  Bottom 0.203: v28.61,22.99 32.32,22.99 v33.29,23.95
V
  Top 0.203: R1.P$1 4.02,20.94 | 4.02,20.94 | 4.02,20.94 4,20.95 ST1.2
VCC  (via drill 0.51)
  Top 0.203: IC4.38 13.22,24.43 13.2,24.41 12.74,24.41 12.71,24.43 IC4.39 12.72,25.28 12.71,25.38 10.43,25.38 | C21.1 8.32,11.25 IC1.13 7.73,10.57 7.73,10.29 7.94,10.29 8.24,9.98 8.24,9.78 8.52,9.78 IC1.12 9.92,11.1 C22.1 10.95,11.74 v11.04,11.84 13.72,14.51 IC4.14 | IC1.15 6.42,11.9 C24.1 6.24,11.96 v5.32,11.96 | v1.66,10.22 1.03,9.56 L10.1 1.03,8.41 C23.1 | v16.55,6.3 20.32,6.3 L11.2 | S1.2.1 10.05,25.38 10.43,25.38 | v5.8,19.41 5.8,20.6 10.43,25.22 10.43,25.38 | 6.51,6.87 IC1.6 6.42,4.32 v6.44,4.3
  Top 0.254: C20.1 L11.2
  Bottom 0.203: 5.32,11.84 3.31,11.84 v1.66,10.22 1.66,9.1 v6.44,4.3 | 5.32,11.84 v11.04,11.84 11.04,11.81 v16.55,6.3 | 5.32,11.84 v5.32,11.96 5.37,12.04 5.37,18.97 v5.8,19.41
VCC_EXT  (via drill 0.51)
  Top 0.203: v8.9,28.57 7.68,29.79 7.68,30.15 S1.1.1 | v6.67,26.34 6.67,22.17 6.29,21.79 6.16,21.79 C2.2 5.1,21.74 C1.2 5.09,21.08 R1.P$2 4.9,20.88 R5.P$1
  Bottom 0.203: v6.67,26.34 v8.9,28.57

### Text on the board
tNames: V 1.0 Rev A | Village Base Station | TIER Wakeup Radio | Kashif Ali & Kurtis Heimerl | TIER Lab, EECS | UC Berkeley